# Altium project AltiumClass2026_DemoPCB.PrjPcb
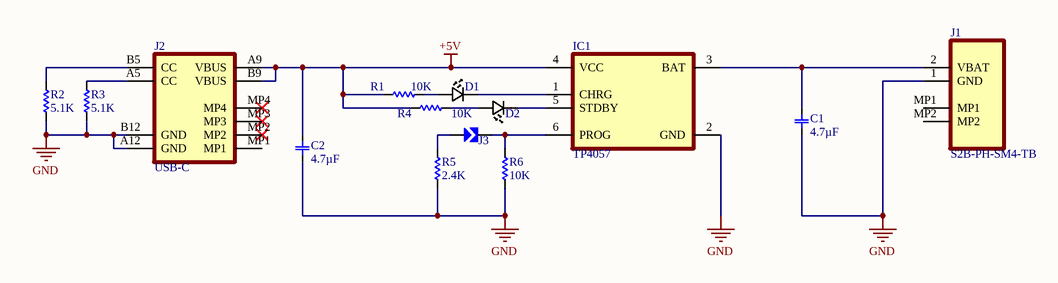
[diagram p0: SebastianAltiumClassSCH.SchDoc]
1 sheet, 14 parts. Net scope: global (net labels, ports and power ports of the same name join across sheets).
Board file: SebastianAltiumClassPCB.PcbDoc

## Sheet SebastianAltiumClassSCH.SchDoc
size A; SheetNumber: 1; SheetTotal: 1

### Parts
C1  Capacitance: 4.7µF  [CAP0603]  (hidden comment: 4.7uF)
C2  Capacitance: 4.7µF  [CAP0603]  (hidden comment: 4.7uF)
D1  LED  [LED0603]  (value not drawn)
D2  LED  [LED0603]  (value not drawn)
IC1  TP4057  [SOT95P280X125-6N]
J1  S2B-PH-SM4-TB  [S2BPHSM4TBLFSN]
J2  USB-C  [USBC]
J3  SOLDERBRIDGE  [SOLDERBRIDGE]  (value not drawn)
R1  10K  [RES0603]
R2  5.1K  [RES0603]
R3  5.1K  [RES0603]
R4  10K  [RES0603]
R5  2.4K  [RES0603]
R6  10K  [RES0603]

### Nets
+5V: C2.2 IC1.4(VCC) J2.A9(VBUS) J2.B9(VBUS) R1.1 R4.1
GND: C1.1 C2.1 IC1.2(GND) J1.1(GND) J2.A12(GND) J2.B12(GND) R2.1 R3.1 R5.1 R6.1
NetC1_2: C1.2 IC1.3(BAT) J1.2(VBAT)
NetD1_1: D1.1(K) IC1.1(CHRG)
NetD1_2: D1.2(A) R1.2
NetD2_1: D2.1(K) IC1.5(STDBY)
NetD2_2: D2.2(A) R4.2
NetIC1_6: IC1.6(PROG) J3.2 R6.2
NetJ2_A5: J2.A5(CC) R3.2
NetJ2_B5: J2.B5(CC) R2.2
NetJ3_1: J3.1 R5.2

Not connected (* = marked no-connect by the designer): J1 MP1 MP2; J2 MP1 MP2* MP3* MP4*

### Library data of the parts
C1 C2 = Capacitor_4.7uF: 4.7uF Capacitor, 0603
D1 D2 = LED: LED, 0603
IC1 = TP4057: Lithium-Ion Battery Charger, 500mA max; Manufacturer_Name: Nanjing Extension Microelectronics; Manufacturer_Part_Number: TP4057-42-SOT26-R; Datasheet Link: https://datasheet.lcsc.com/szlcsc/Nanjing-Extension-Microelectronics-TP4057_C12044.pdf; Height: 1.25mm
J1 = S2B-PH-SM4-TB: DigiKey Part - / PH Series 2 pin connector - / S2B-PH-SM4-TB; Manufacturer_Name: JST (JAPAN SOLDERLESS TERMINALS); Manufacturer_Part_Number: S2B-PH-SM4-TB(LF)(SN); Datasheet Link: https://www.jst-mfg.com/product/pdf/eng/ePH.pdf; Height: 6.6mm; Mouser Part Number: N/A; Mouser Price/Stock: https://www.mouser.co.uk/ProductDetail/JST-Commercial/S2B-PH-SM4-TBLFSN?qs=QpmGXVUTftEA9IU90i0xlg%3D%3D; Arrow Part Number: S2B-PH-SM4-TB(LF)(SN); Arrow Price/Stock: https://www.arrow.com/en/products/s2b-ph-sm4-tb-lf-sn/jst-manufacturing?utm_currency=USD&region=europe
J2 = USB-C: USB-C Port, Power Only
R1 R4 R6 = Resistor_10K: 10K Resistor, 0603; Resistance: 10K
R2 R3 = Resistor_5.1K: 5.1K Resistor, 0603; Resistance: 5.1K
R5 = Resistor_2K: 2.4K Resistor, 0603; Resistance: 2.4K